# Altium schematic sheet 01 TITLE PAGE.SchDoc
size 513 x 386 mm
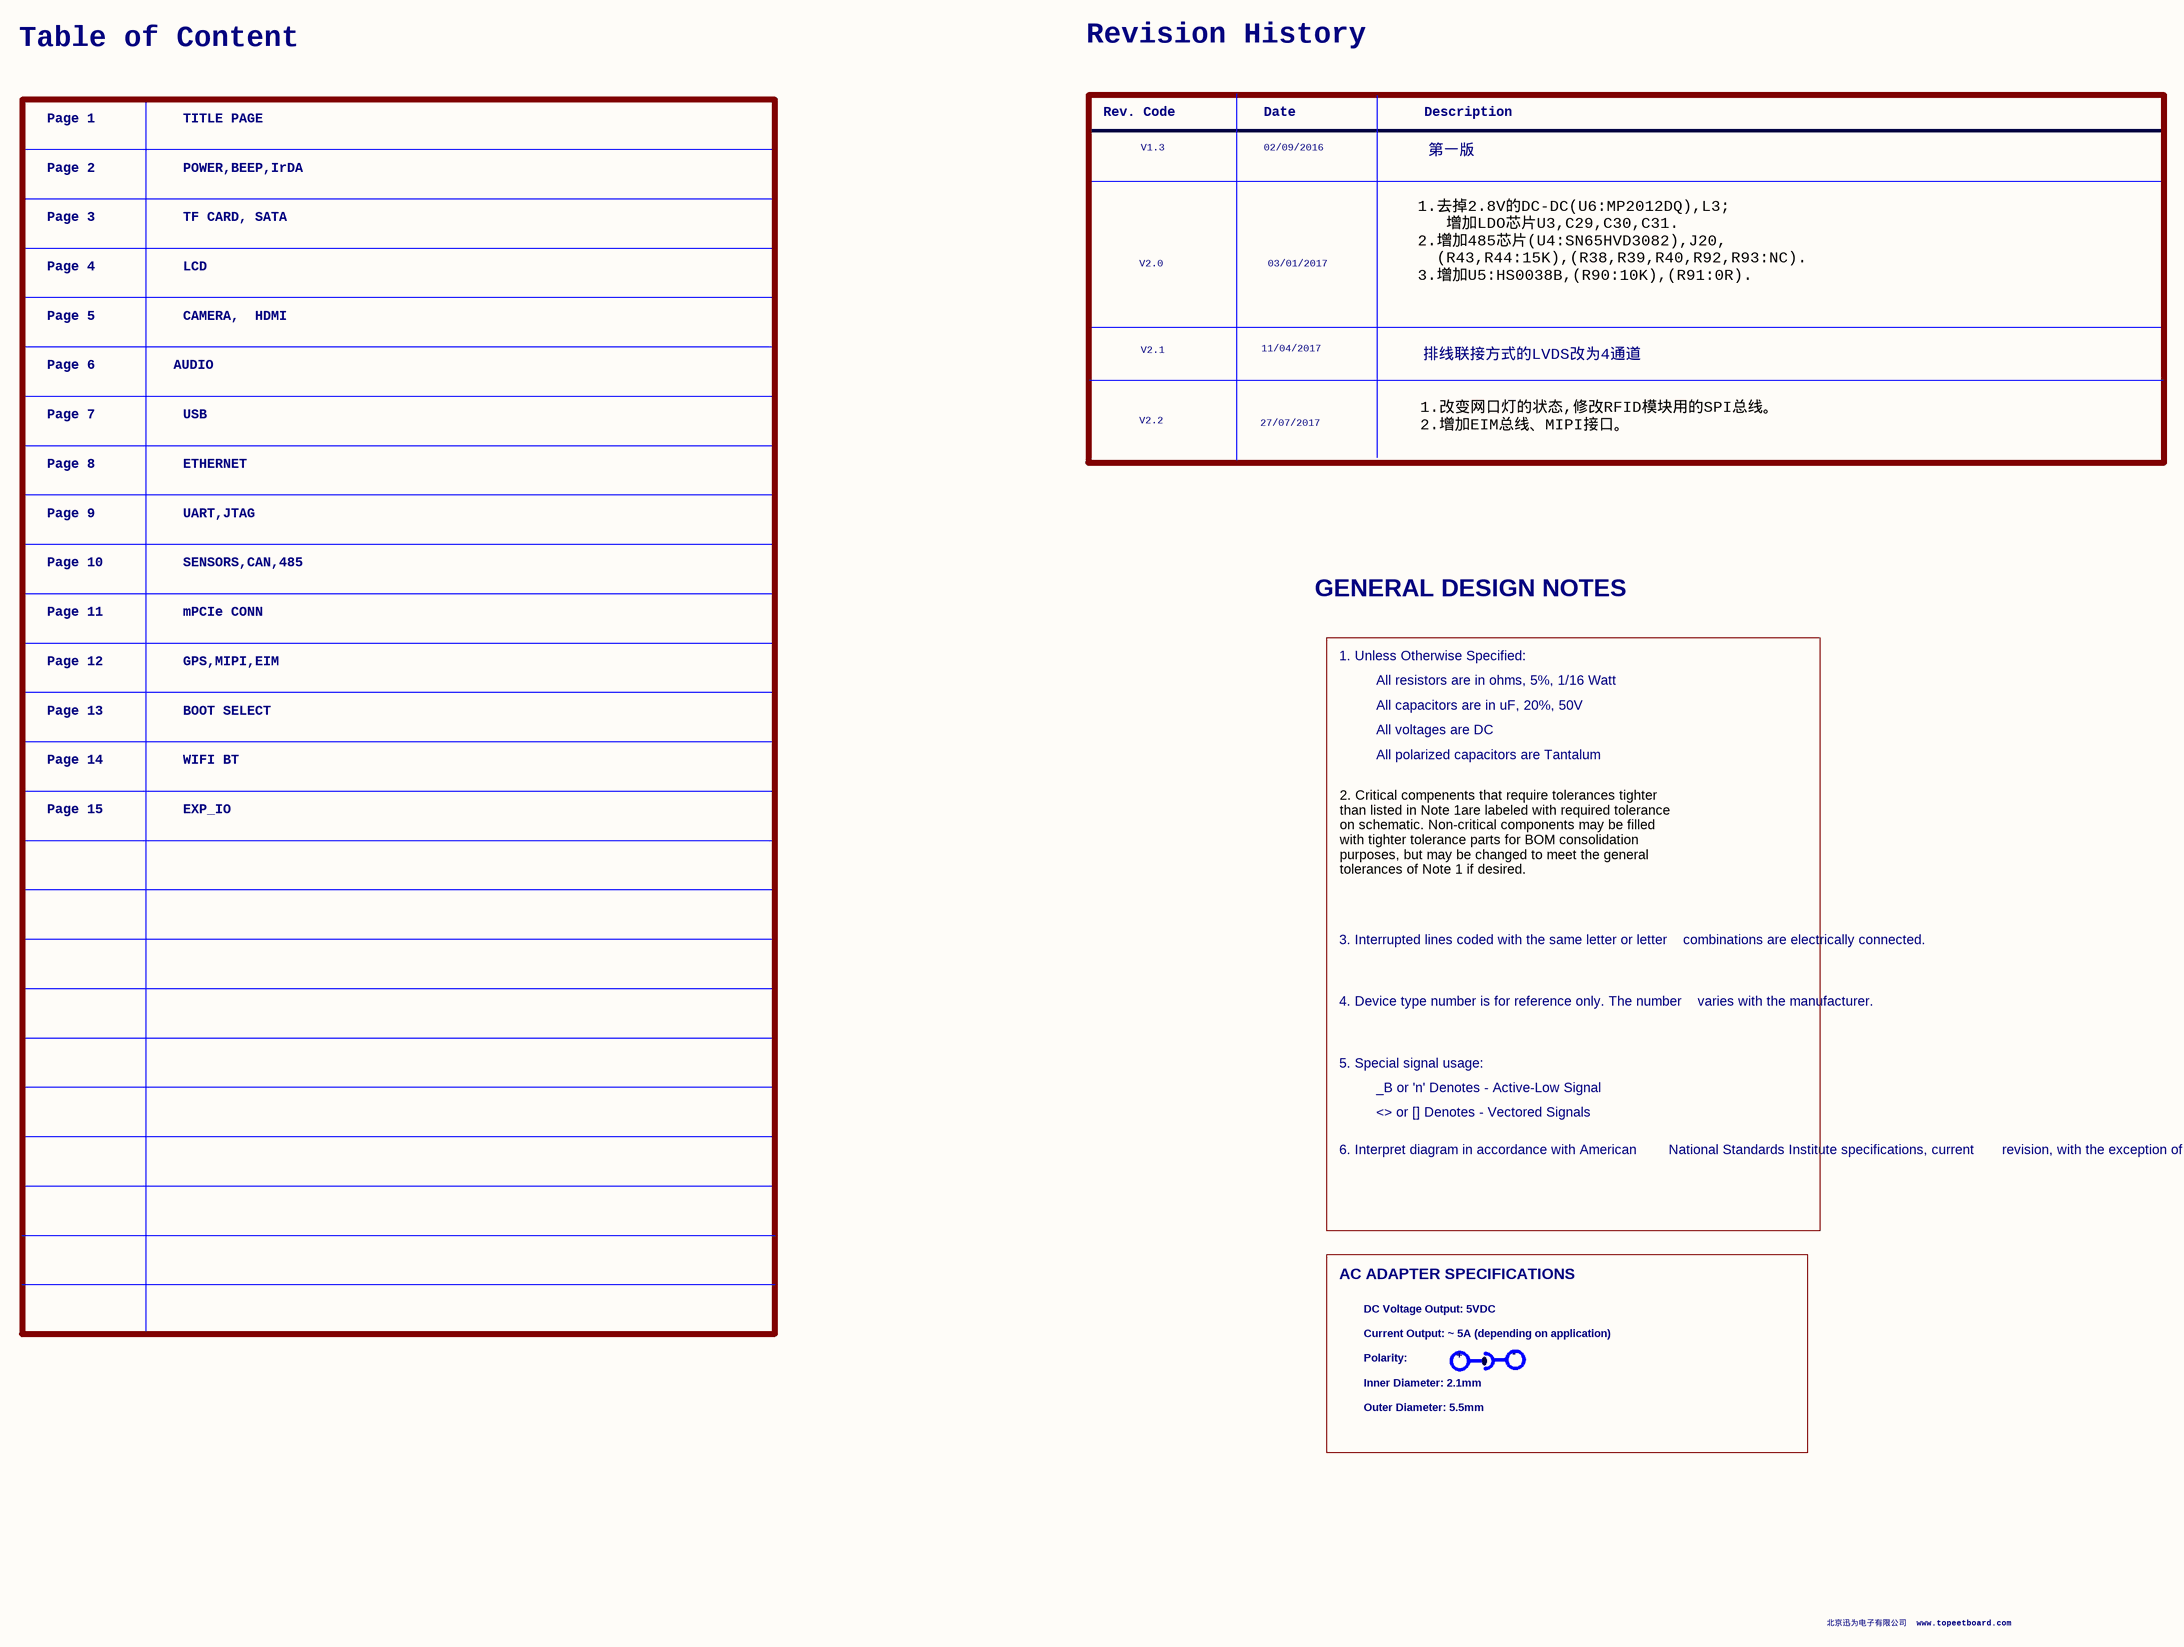
[diagram p0: 01 TITLE PAGE.SchDoc]

## Notes on the sheet
- Table of Content
- Revision History
- Page 1
- TITLE PAGE
- Rev. Code
- V1.3
- Date
- 02/09/2016
- Description
- 第一版
- Page 2
- Page 3
- TF CARD, SATA
- POWER,BEEP,IrDA
- 1.去掉2.8V的DC-DC(U6:MP2012DQ),L3;
  增加LDO芯片U3,C29,C30,C31.
  2.增加485芯片(U4:SN65HVD3082),J20,
  (R43,R44:15K),(R38,R39,R40,R92,R93:NC).
  3.增加U5:HS0038B,(R90:10K),(R91:0R).
- Page 4
- LCD
- V2.0
- 03/01/2017
- Page 5
- CAMERA,  HDMI
- Page 6
- AUDIO
- V2.1
- 11/04/2017
- 1.改变网口灯的状态,修改RFID模块用的SPI总线。
  2.增加EIM总线、MIPI接口。
- 排线联接方式的LVDS改为4通道
- Page 7
- Page 8
- USB
- ETHERNET
- V2.2
- 27/07/2017
- Page 9
- UART,JTAG
- Page 10
- SENSORS,CAN,485
- Page 11
- mPCIe CONN
- GENERAL DESIGN NOTES
- Page 12
- Page 13
- GPS,MIPI,EIM
- BOOT SELECT
- 1. Unless Otherwise Specified:
- All resistors are in ohms, 5%, 1/16 Watt
- All capacitors are in uF, 20%, 50V
- Page 14
- WIFI BT
- All voltages are DC
- All polarized capacitors are Tantalum
- Page 15
- EXP_IO
- 2. Critical compenents that require tolerances tighter
  than listed in Note 1are labeled with required tolerance
  on schematic. Non-critical components may be filled
  with tighter tolerance parts for BOM consolidation
  purposes, but may be changed to meet the general
  tolerances of Note 1 if desired.
- 3. Interrupted lines coded with the same letter or letter    combinations are electrically connected.
- 4. Device type number is for reference only. The number    varies with the manufacturer.
- 5. Special signal usage:
- _B or 'n' Denotes - Active-Low Signal
- <> or [] Denotes - Vectored Signals
- 6. Interpret diagram in accordance with American        National Standards Institute specifications, current       revision, with the exception of logic block symbology.
- AC ADAPTER SPECIFICATIONS
- DC Voltage Output: 5VDC
- Inner Diameter: 2.1mm
- Polarity:
- Current Output: ~ 5A (depending on application)
- +
- -
- Outer Diameter: 5.5mm
- 北京迅为电子有限公司  www.topeetboard.com